# Altium schematic sheet 5_Periperals.SchDoc
size A4; SheetNumber: 5; SheetTotal: 7
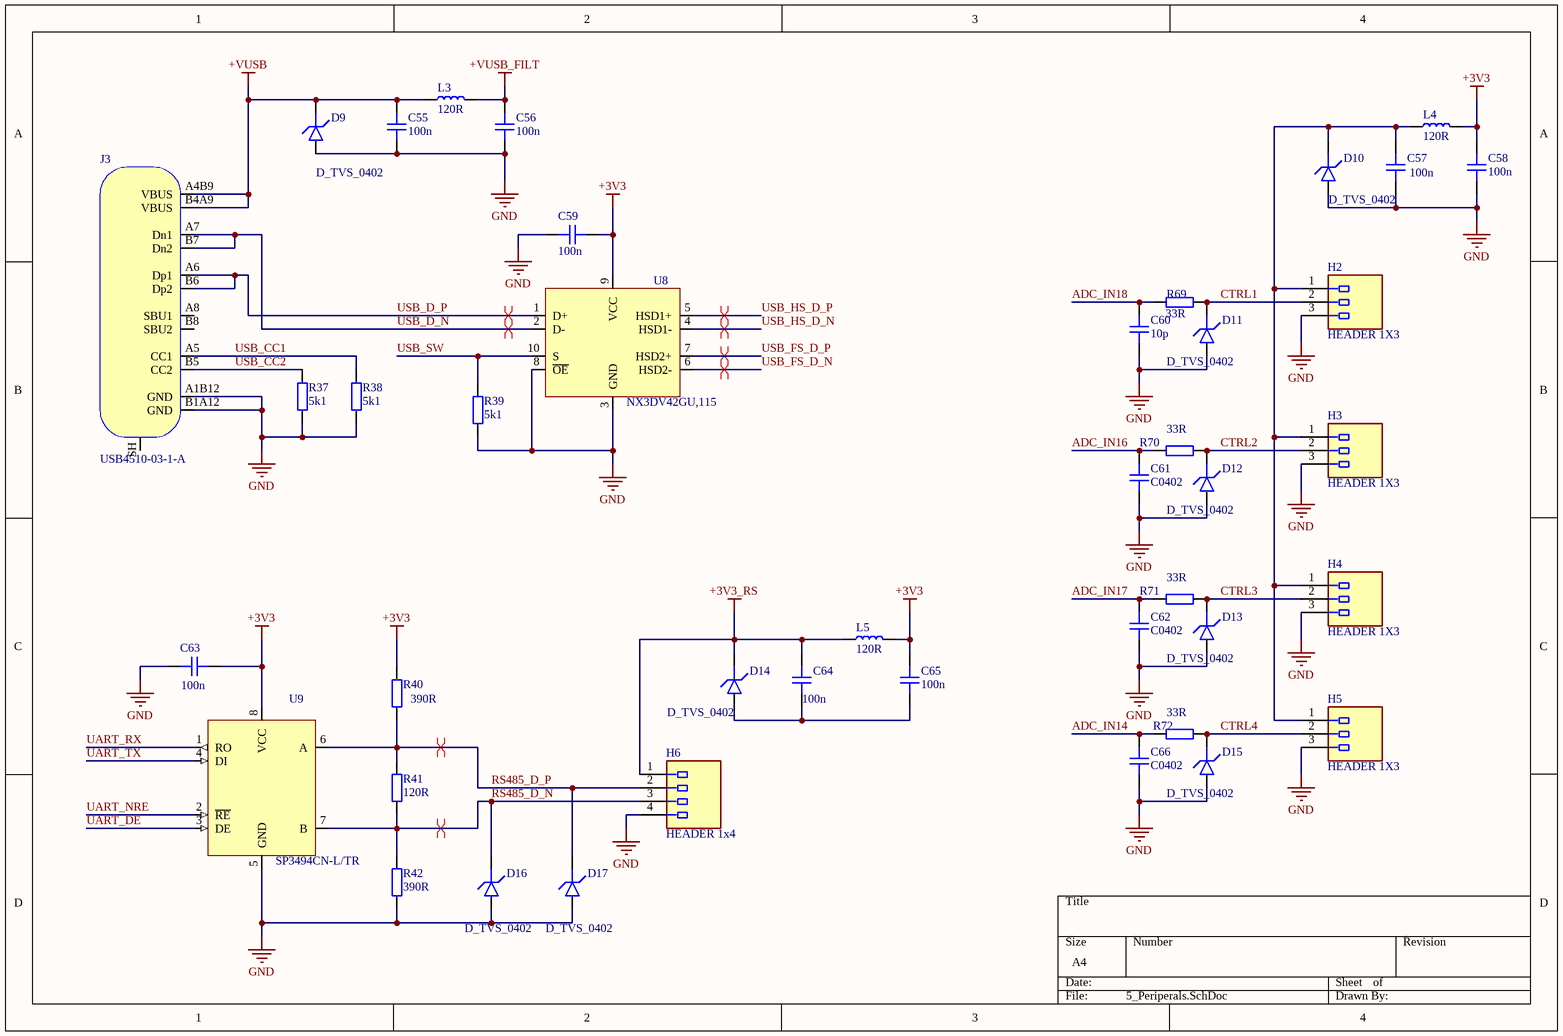
[diagram p0: 5_Periperals.SchDoc]

## Parts
C55  100n  [CAP_0402]
C56  100n  [CAP_0402]
C57  100n  [CAP_0402]
C58  100n  [CAP_0402]
C59  100n  [CAP_0402]
C60  10p  [CAP_0402]
C61  C0402  [CAP_0402]
C62  C0402  [CAP_0402]
C63  100n  [CAP_0402]
C64  100n  [CAP_0402]
C65  100n  [CAP_0402]
C66  C0402  [CAP_0402]
D9  D_TVS_0402  [D_0402]
D10  D_TVS_0402  [D_0402]
D11  D_TVS_0402  [D_0402]
D12  D_TVS_0402  [D_0402]
D13  D_TVS_0402  [D_0402]
D14  D_TVS_0402  [D_0402]
D15  D_TVS_0402  [D_0402]
D16  D_TVS_0402  [D_0402]
D17  D_TVS_0402  [D_0402]
H2  HEADER 1X3  [053048-0310]
H3  HEADER 1X3  [053048-0310]
H4  HEADER 1X3  [053048-0310]
H5  HEADER 1X3  [053048-0310]
H6  HEADER 1x4  [053048-0410]
J3  USB4510-03-1-A  [USB4510-03-1-A]
L3  120R  [IND_0402]
L4  120R  [IND_0402]
L5  120R  [IND_0402]
R37  5k1  [RES_0402]
R38  5k1  [RES_0402]
R39  5k1  [RES_0402]
R40  390R  [RES_0402]
R41  120R  [RES_0402]
R42  390R  [RES_0402]
R69  33R  [RES_0402]
R70  33R  [RES_0402]
R71  33R  [RES_0402]
R72  33R  [RES_0402]
U8  NX3DV42GU,115  [XQFN-10_SOT1160-1]
U9  SP3494CN-L/TR  [SOIC-8]

## Nets
+3V3: C58.1 C59.1 C63.2 C65.1 L4.2 L5.2 R40.2 U8.9(VCC) U9.8(VCC)
+3V3_RS: C64.1 D14.K H6.1 L5.1
+VUSB: C55.1 D9.K J3.A4B9(VBUS) J3.B4A9(VBUS) L3.1
+VUSB_FILT: C56.1 L3.2
GND: C55.2 C56.2 C57.2 C58.2 C59.2 C60.2 C61.2 C62.2 C63.1 C66.2 D9.A D10.A D11.A D12.A D13.A D15.A D16.A D17.A H2.3 H3.3 H4.3 H5.3 H6.4 J3.A1B12(GND) J3.B1A12(GND) R37.1 R38.1 R39.1 R42.1 U8.3(GND) U8.8(~{OE}) U9.5(GND)
ADC_IN14: C66.1 R72.1
ADC_IN16: C61.1 R70.1
ADC_IN17: C62.1 R71.1
ADC_IN18: C60.1 R69.1
CTRL1: D11.K H2.2 R69.2
CTRL2: D12.K H3.2 R70.2
CTRL3: D13.K H4.2 R71.2
CTRL4: D15.K H5.2 R72.2
RS485_D_N: D16.K H6.3 R41.1 R42.2 U9.7(B)
RS485_D_P: D17.K H6.2 R40.1 R41.2 U9.6(A)
UART_DE: U9.3(DE)
UART_NRE: U9.2(~{RE})
UART_RX: U9.1(RO)
UART_TX: U9.4(DI)
USB_CC1: J3.A5(CC1) R38.2
USB_CC2: J3.B5(CC2) R37.2
USB_D_N: J3.A7(Dn1) J3.B7(Dn2) U8.2(D-)
USB_D_P: J3.A6(Dp1) J3.B6(Dp2) U8.1(D+)
USB_FS_D_N: U8.6(HSD2-)
USB_FS_D_P: U8.7(HSD2+)
USB_HS_D_N: U8.4(HSD1-)
USB_HS_D_P: U8.5(HSD1+)
USB_SW: R39.2 U8.10(S)
NetC57_1: C57.1 D10.K H2.1 H3.1 H4.1 H5.1 L4.1
NetC64_2: C64.2 C65.2 D14.A

Not connected (* = marked no-connect by the designer): J3 A8(SBU1) B8(SBU2) SH(SHIELD)

## Layout directives
differential pair: RS485_D_N, RS485_D_P, USB_D_N, USB_D_P, USB_FS_D_N, USB_FS_D_P, USB_HS_D_N, USB_HS_D_P

## Library data of the parts
C55-C66 = CAP_0402: Capacitor SMD 0402; Manufacturer: *; Manufacturer Part Number: *; Distributor Link: *; LCSC: *; Rating: *; Dielectric: *
D9-D17 = D_TVS_0402: Diode TVS / ESD 0402
H2-H5 = 053048-0310
H6 = 053048-0410
J3 = USB4510-03-1-A: USB Connector Type C SMT Mid-Mount 16 Pin; Manufacturer: GCT; Manufacturer Part Number: USB4510-03-1-A
L3-L5 = IND_0402: Inductor SMD 0402
R37-R42 R69-R72 = RES_0402: Resistor SMD 0402; Manufacturer: *; Manufacturer Part Number: *; Distributor Link: *; LCSC: *
U8 = NX3DV42GU,115: USB2.0 HS DPDT Switch; Manufacturer: NXP Semiconductors; Manufacturer Part Number: NX3DV42GU,115
U9 = SP3494CN-L/TR: 3.3V Low Power RS-485 / RS-422 Transceiver SOIC-8; Manufacturer: MaxLinear; Manufacturer Part Number: SP3494CN-L/TR